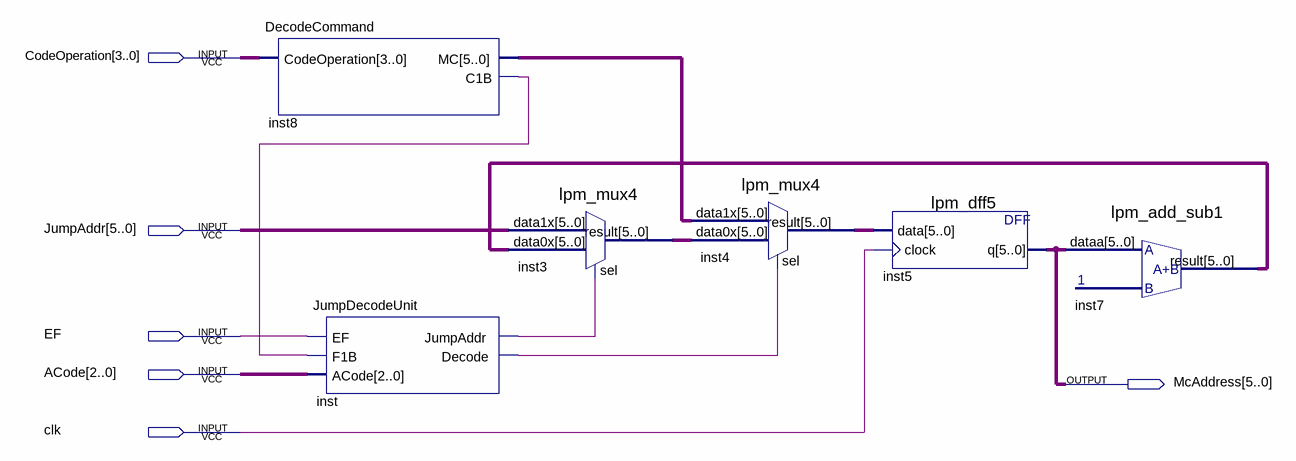
[diagram p0: schematic sheet]
// Quartus schematic UFA.bdf as structural Verilog: 6 symbols, 6 pins
module UFA (
  input  [3:0] CodeOperation,
  input  [5:0] JumpAddr,
  input  EF,
  input  [2:0] ACode,
  input  clk,
  output [5:0] McAddress
);

  wire inst8_c1b, inst_decode, inst_jumpaddr;
  wire [5:0] inst3_result, inst4_result, inst7_result, inst8_mc;

  DecodeCommand inst8 (.CodeOperation(CodeOperation), .MC(inst8_mc), .C1B(inst8_c1b));
  JumpDecodeUnit inst (.EF(EF), .F1B(inst8_c1b), .ACode(ACode), .JumpAddr(inst_jumpaddr), .Decode(inst_decode));
  lpm_mux4 inst3 (.data1x(JumpAddr), .data0x(inst7_result), .sel(inst_jumpaddr), .result(inst3_result));
  lpm_mux4 inst4 (.data1x(inst8_mc), .data0x(inst3_result), .sel(inst_decode), .result(inst4_result));
  lpm_dff5 inst5 (.data(inst4_result), .clock(clk), .q(McAddress));
  lpm_add_sub1 inst7 (.dataa(McAddress), .result(inst7_result));
endmodule
